# EAGLE design driver-ha-v2 (EAGLE 6.5.0)
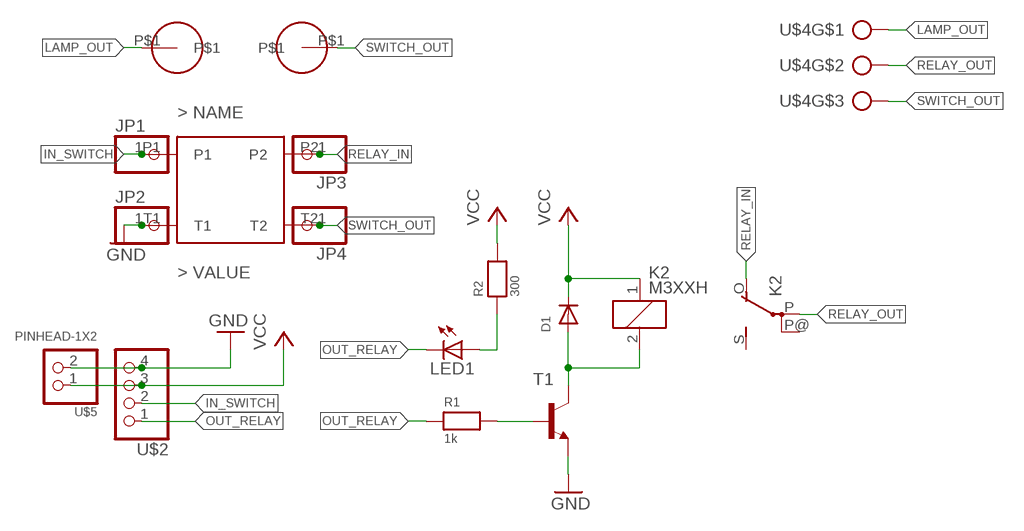
[diagram p0: schematic, sheet 1]

## Parts
D1  DIODESMA  [SMADIODE]
JP1  PINHD-1X1  [1X01]
JP2  PINHD-1X1  [1X01]
JP3  PINHD-1X1  [1X01]
JP4  PINHD-1X1  [1X01]
K2  M3XXH  [M3XXH]
LED1  LEDCHIPLED_0805  [CHIPLED_0805]
R1  1k  RESISTOR0603  [0603]
R2  300  RESISTOR0603  [0603]
ROOM_SWITCH  DPST-SWITCH-1221  [TOGGLE-SW-E1221]
T1  MMBT2222ALT1-NPN-SOT23-BEC  [SOT23-BEC]
U$1  CONN-CABLE  [CONN-CABLE]
U$2  HEADER-1X4  [1X04_OVAL]
U$3  CONN-CABLE  [CONN-CABLE]
U$4  AK3003  [AK3003]
U$5  PINHEAD-1X2  [PIHEAD-1X2]

## Nets
GND: JP2.1 ROOM_SWITCH.T1 T1.E U$2.4 U$5.2
IN_SWITCH: JP1.1 ROOM_SWITCH.P1 U$2.2
LAMP_OUT: U$1.P$1 U$4.1
N$1: R1.2 T1.B
N$2: LED1.A R2.1
N$3: D1.A K2.2 T1.C
OUT_RELAY: LED1.C R1.1 U$2.1
RELAY_IN: JP3.1 K2.O(2:O) ROOM_SWITCH.P2
RELAY_OUT: K2.P(2:P) U$4.2
SWITCH_OUT: JP4.1 ROOM_SWITCH.T2 U$3.P$1 U$4.3
VCC: D1.C K2.1 R2.2 U$2.3 U$5.1
Unconnected: K2.P@(2:P) K2.S(2:S)

## Library data of the parts
D1 = adafruit:DIODE: Diode SMADIODE - SMA Surface Mount Package 20V 1A Schottky Diode Digikey: 641-1014-6-ND DO-1N4148 - Through Hole Small Current Diode SOD-123 20V 1 A (.5mV Vf) Schottky Diode - Digikey: MBRX120TPMSCT-ND SOD-323 10V 570mA (.38mV Vf, 3ns) Schottky Diode - Digikey: ZLLS410CT-ND SOD-523 30V 30mA Schottky Diode (RB751S-40TE61) - Digikey: RB751S-40TE61CT-ND SOT23-R/W - SOT23 Package (R = Solder Paste/Reflow Ovens, W = Hand-Soldering) BAT54Film 40V 300mA - Digikey: 497-7162-1-ND
JP1-JP4 = pinhead:PINHD-1X1: PIN HEADER
K2 = relay:M3XXH: RELAY 1 x switch; OC_FARNELL: unknown; OC_NEWARK: unknown
LED1 = adafruit:LED: LED OSRAM: - CHIPLED LG R971, LG N971, LY N971, LG Q971, LY Q971, LO R971, LY R971 LH N974, LH R974 LS Q976, LO Q976, LY Q976 LO Q996 - Hyper CHIPLED LW Q18S LB Q993, LB Q99A, LB R99A - SideLED LS A670, LO A670, LY A670, LG A670, LP A670 LB A673, LV A673, LT A673, LW A673 LH A674 LY A675 LS A676, LA A676, LO A676, LY A676, LW A676 LS A679, LY A679, LG A679 - Hyper Micro SIDELED® LS Y876, LA Y876, LO Y876, LY Y876 LT Y87S - SmartLED LW L88C, LW L88S LB L89C, LB L89S, LG L890 LS L89K, LO L89K, LY L89K LS L896, LA L896, LO L896, LY L896 - TOPLED LS T670, LO T670, LY T670, LG T670, LP T670 LSG T670, LSP T670, LSY T670, LOP T670, LYG T670 LG T671, LOG T671, LSG T671 LB T673, LV T673, LT T673, LW T673 LH T674 LS T676, LA T676, LO T676, LY T676, LB T676, LH T676, LSB T676, LW T676 LB T67C, LV T67C, LT T67C, LS T67K, LO T67K, LY T67K, LW E67C LS E67B, LA E67B, LO E67B, LY E67B, LB E67C, LV E67C, LT E67C LW T67C LS T679, LY T679, LG T679 LS T770, LO T770, LY T770, LG T770, LP T770 LB T773, LV T773, LT T773, LW T773 LH T774 LS E675, LA E675, LY E675, LS T675 LS T776, LA T776, LO T776, LY T776, LB T776 LHGB T686 LT T68C, LB T68C - Hyper Mini TOPLED® LB M676 - Mini TOPLED Santana® LG M470 LS M47K, LO M47K, LY M47K Source: http://www.osram.convergy.de/
R1 R2 = microbuilder:RESISTOR: Resistors 0402 - 0402 Surface Mount Package 22 Ohm 1% 1/16W [Digikey: 311-22.0LRTR-ND] 33 Ohm 5% 1/16W 1.0K 5% 1/16W 1.5K 5% 1/16W 2.0K 1% 1/16W 10.0K 1% 1/16W [Digikey: 311-10.0KLRTR-ND] 10.0K 5% 1/16W [Digikey: RMCF0402JT10K0TR-ND] 12.1K 1% 1/16W [Digikey: 311-22.0LRTR-ND] 100.0K 5% 1/16W 0603 - 0603 Surface Mount Package 0 Ohm 1/10 Watt 1% Resistor 15 Ohm 1/10 Watt 1% Resistor 33 Ohm 1/10 Watt 1% Resistor 49.9 Ohm 1/10 Watt 1% Resistor 100 Ohm 1/10 Watt 1% Resistor 150 Ohm 1/10 Watt 1% Resistor 240 Ohm 1/10 Watt 1% Resistor 390 Ohm 1/10 Watt 1% Resistor 560 Ohm 1/10 Watt 1% Resistor 680 Ohm 1/10 Watt 1% Resistor 750 Ohm 1/10 Watt 1% Resistor 1.0K Ohm 1/10 Watt 1% Resistor 1.5K Ohm 1/10 Watt 1% Resistor 2.0K Ohm 1/10 Watt 1% Resistor 2.2K Ohm 1/10 Watt 1% Resistor 3.3K Ohm 1/10 Watt 1% Resistor 4.7K Ohm 1/10 Watt 1% Resistor 10.0K Ohm 1/10 Watt 1% Resistor 12.0K Ohm 1/10 Watt 1% Resistor 12.1K Ohm 1/10 Watt 1% Resistor 20.0K Ohm 1/10 Watt 1% Resistor 33.0K Ohm 1/10 Watt 1% Resistor 100.0K Ohm 1/10 Watt 1% Resistor 0805 - 0805 Surface Mount Package 0 Ohm 1/8 Watt 1% Resistor 33 Ohm 1/8 Watt 1% Resistor 100 Ohm 1/8 Watt 1% Resistor 150 Ohm 1/8 Watt 1% Resistor 200 Ohm 1/8 Watt 1% Resistor 240 Ohm 1/8 Watt 1% Resistor 330 Ohm 1/8 Watt 1% Resistor 390 Ohm 1/8 Watt 1% Resistor 470 Ohm 1/8 Watt 1% Resistor 1.0K Ohm 1/8 Watt 1% Resistor 1.5K Ohm 1/8 Watt 1% Resistor 2.0K Ohm 1/8 Watt 1% Resistor 4.7K Ohm 1/8 Watt 1% Resistor 5.1K Ohm 1/8 Watt 1% Resistor 5.6K Ohm 1/8 Watt 1% Resistor 10.0K Ohm 1/8 Watt 1% Resistor 22.0K Ohm 1/8 Watt 1% Resistor 33.0K Ohm 1/8 Watt 1% Resistor 100K Ohm 1/8 Watt 1% Resistor 1206 - 1206 Surface Mount Package 2012 - 2010 Surface Mount Package 0.11 Ohm 1/2 Watt 1% Resistor - Digikey: RHM.11UCT-ND
ROOM_SWITCH = bontor:DPST-SWITCH-1221
T1 = transistor-neu-to92:*-NPN-: NPN Transistror
U$1 U$3 = bontor:CONN-CABLE
U$2 = microbuilder:HEADER-1X4: PIN HEADER
U$4 = con-ptr500:AK3003
U$5 = bontor-baseapp:PINHEAD-1X2

## Net classes
0 default: width 0.305 mm, drill 0.508 mm, clearance 5.08 mm

## Board
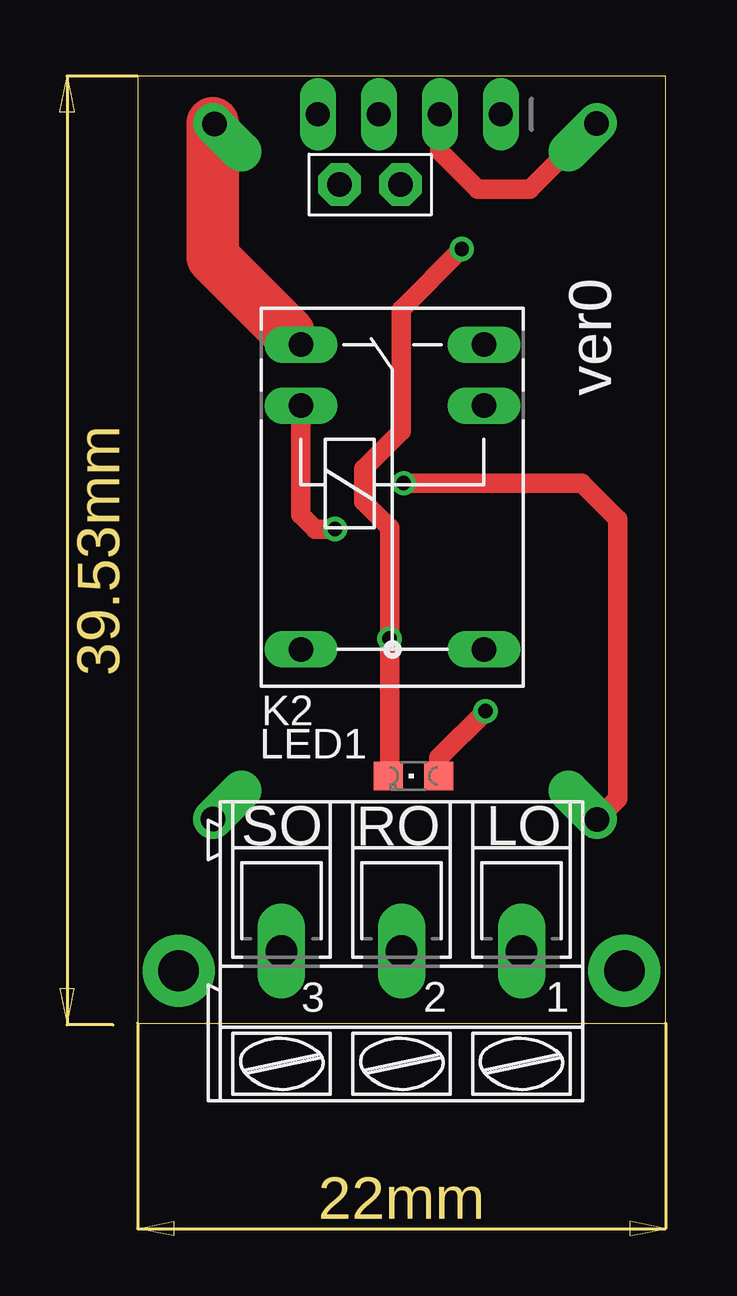
[diagram p1: board, top side]
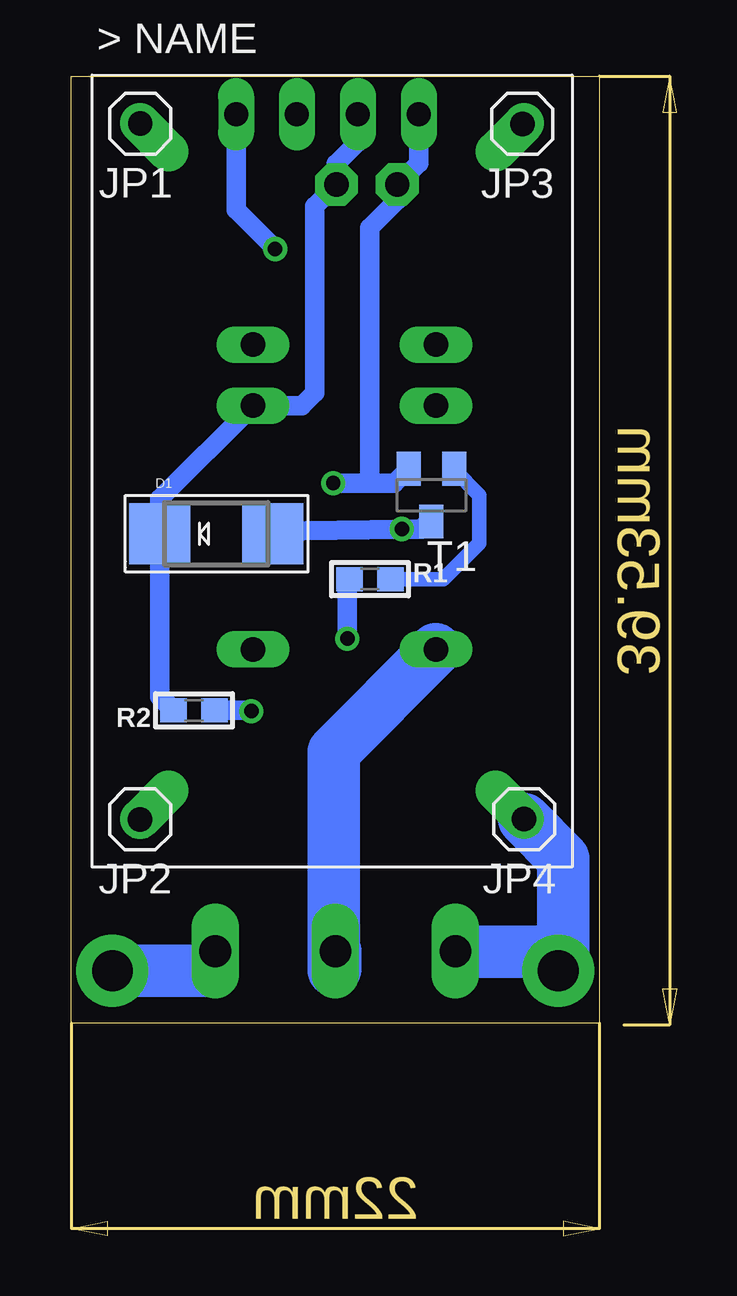
[diagram p2: board, bottom side, seen from below]

Size 22 x 39.46 mm. Coordinates in mm from the lower left corner, seen from the top.
Outline: 22,39.46 0,39.46 0,0 22,0 22,39.46
Copper layers (1*16): Top 0.035mm / dielectric 1.5mm / Bottom 0.035mm
Design rules "default": minimum track width 10mil, minimum drill 24mil, track to track 8mil, track to pad 8mil, pad to pad 8mil, via to via 8mil, smd to smd 8mil, copper to edge 40mil, drill to drill 8mil, minimum pad ring 10mil, minimum via ring 8mil, stop-mask expansion 4mil, vias tented up to drill 0mil, thermal gap 10mil

### Footprints (pad centres in the part's own frame; a part is rotated, then mirrored left to right if it is on the bottom)
SMADIODE = smd 2.54 x 2.54: A 2.349,0; C -2.349,0
1X01 = drill 1.016 octagon: 1 0,0
M3XXH = drill 1.016 long: 1 -3.81,3.81; 2 -3.81,-3.81; O -6.35,-3.81; P 6.35,-3.81; P@ 6.35,3.81; S -6.35,3.81
CHIPLED_0805 = smd 1.2 x 1.2: A 0,-1.05; C 0,1.05
0603 = smd 1.1 x 1: 1 -0.85,0; 2 0.85,0
TOGGLE-SW-E1221 = drill 0.8 pad 1.676 offset: P1 -8,14.5; P2 8,14.5; T1 -8,-14.5; T2 8,-14.5
SOT23-BEC = smd 1 x 1.4: B -0.95,-1.1; C 0,1.1; E 0.95,-1.1
CONN-CABLE = drill 1.7 pad 3: P$1 0,0
1X04_OVAL = drill 1 long: 1 -3.81,0; 2 -1.27,0; 3 1.27,0; 4 3.81,0
AK3003 = drill 1.321 long: 1 -5.004,0; 2 0,0; 3 5.004,0
PIHEAD-1X2 = drill 1.016 pad 1.778 octagon: 1 -1.27,0; 2 1.27,0

### Placement (x,y rotation side)
D1  15.96,20.39 0 bottom
JP1  19.13,37.48 180 bottom
JP2  19.14,8.49 180 bottom
JP3  3.21,37.47 180 bottom
JP4  3.14,8.5 180 bottom
K2  10.62,21.92 270 top
LED1  11.5,10.3 90 top
R1  9.56,18.5 0 bottom
R2  16.89,13.03 180 bottom
ROOM_SWITCH  11.14,23 0 bottom
T1  7,22 180 bottom
U$1  20.29,2.19 180 top
U$2  11.33,37.87 180 top
U$3  1.71,2.19 180 top
U$4  11,3 180 top
U$5  9.69,34.94 180 top

### Tracks (layer width: path | path; a pad name or v marks a point on that pad's centre or on a via)
GND  (via drill 0.6)
  Top 0.406: ROOM_SWITCH.T1 JP2.1
  Top 0.813: ROOM_SWITCH.T1 20,9.36 20,21 18.5,22.5 v11.09,22.5
  Bottom 0.813: v11.09,22.5 9.47,22.5 | 9.47,22.5 8.55,22.5 T1.E | 8,23.15 T1.E | 7.95,23.41 T1.E | U$2.4 7.52,35.84 U$5.2 8.42,34.29 9.56,33.15 9.56,22.59 9.47,22.5
IN_SWITCH
  Top 0.813: U$2.2 12.6,36.33 14.18,34.75 16.35,34.75 19.08,37.48 JP1.1
  Bottom 0.406: ROOM_SWITCH.P1 JP1.1
LAMP_OUT
  Bottom 1.93: U$4.1 16.12,2.88 16.12,2.21
  Bottom 2.184: U$1.P$1 16.14,2.19 16.12,2.21
N$1
  Bottom 0.61: R1.2 6.5,18.5 5,20 5,22 6.05,23.05 T1.B
N$2  (via drill 0.6)
  Top 0.813: v14.5,13 12.55,11.05 LED1.A
  Bottom 0.813: R2.1 14.53,13.03 v14.5,13
N$3  (via drill 0.6)
  Top 0.813: K2.2 6.81,21.19 7.41,20.59 v8.23,20.59
  Bottom 0.813: T1.C 7.1,20.9 7.41,20.59 v8.23,20.59 13.61,20.5 D1.A
OUT_RELAY  (via drill 0.6)
  Top 0.61: 10.5,17 v10.5,16.02
  Top 0.813: LED1.C 10.5,10.35 v10.5,16.02 10.5,20.65 9.42,21.73 9.42,23.1 10.98,24.66 10.98,29.73 v13.51,32.26
  Bottom 0.61: 10.5,18.41 arc90 R1.1
  Bottom 0.813: 10.5,18.41 v10.5,16.02 | v13.51,32.26 15.14,33.89 U$2.1
RELAY_IN
  Top 0.406: ROOM_SWITCH.P2 3.21,37.5 JP3.1
  Top 1.422: K2.O 6.79,28.27 6.31,28.75
  Top 1.93: 3.14,35.57 3.14,36.86
  Top 2.184: 3.14,36.86 ROOM_SWITCH.P2 3.14,31.92 6.31,28.75
RELAY_OUT
  Bottom 2.184: K2.P 11.07,11.31 11.07,2.2 11,2.27 U$4.2
SWITCH_OUT
  Bottom 1.93: U$4.3 5.92,3 arc90 5.91,2.99 5.89,2.97 5.71,2.97
  Bottom 2.184: JP4.1 1.5,6.86 1.5,2.4 U$3.P$1 2.49,2.97 5.71,2.97
VCC
  Bottom 0.813: U$2.3 10.06,36.7 10.96,35.8 U$5.1 11.87,34.03 11.87,26.26 12.4,25.73 K2.1 18.31,21.85 D1.C 18.31,13.6 R2.2

### Text on the board
tNames: ver0 | SO | RO | LO
tValues: LI | RO | LO